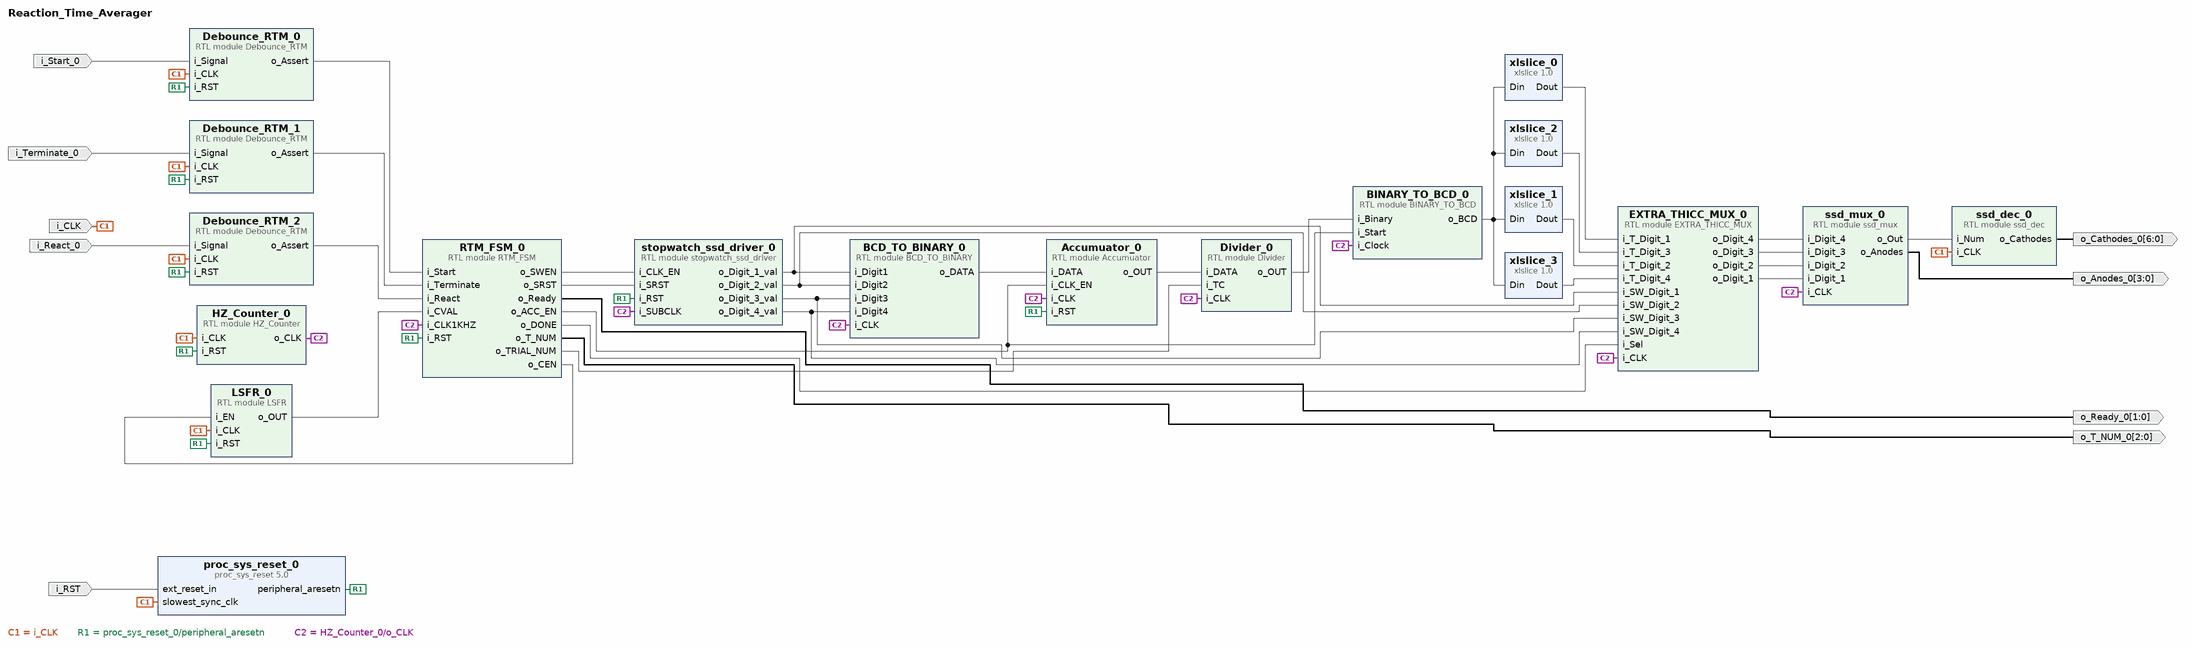
[diagram p0: block diagram of the top level]
# Vivado block design Reaction_Time_Averager, xc7z007sclg400-1, Vivado 2019.1
create_bd_design Reaction_Time_Averager

create_bd_port -dir O -from 3 -to 0 o_Anodes_0
create_bd_port -dir O -from 6 -to 0 o_Cathodes_0
create_bd_port -dir O -from 1 -to 0 o_Ready_0
create_bd_port -dir I -type clk i_CLK
create_bd_port -dir I -type rst i_RST
set_property -dict {CONFIG.POLARITY ACTIVE_LOW} [get_bd_ports i_RST]
create_bd_port -dir O -from 2 -to 0 o_T_NUM_0
create_bd_port -dir I i_Start_0
create_bd_port -dir I i_Terminate_0
create_bd_port -dir I i_React_0

create_bd_cell -type ip -vlnv xilinx.com:ip:proc_sys_reset:5.0 proc_sys_reset_0
create_bd_cell -type module -reference LSFR LSFR_0
create_bd_cell -type module -reference stopwatch_ssd_driver stopwatch_ssd_driver_0
create_bd_cell -type module -reference ssd_mux ssd_mux_0
create_bd_cell -type module -reference ssd_dec ssd_dec_0
create_bd_cell -type module -reference Accumuator Accumuator_0
create_bd_cell -type module -reference BCD_TO_BINARY BCD_TO_BINARY_0
create_bd_cell -type module -reference BINARY_TO_BCD BINARY_TO_BCD_0
create_bd_cell -type module -reference EXTRA_THICC_MUX EXTRA_THICC_MUX_0
create_bd_cell -type module -reference Divider Divider_0
create_bd_cell -type module -reference Debounce_RTM Debounce_RTM_0
create_bd_cell -type module -reference Debounce_RTM Debounce_RTM_1
create_bd_cell -type module -reference Debounce_RTM Debounce_RTM_2
create_bd_cell -type ip -vlnv xilinx.com:ip:xlslice:1.0 xlslice_0
set_property -dict {CONFIG.DIN_FROM 15 CONFIG.DIN_TO 12 CONFIG.DIN_WIDTH 16 CONFIG.DOUT_WIDTH 4} [get_bd_cells xlslice_0]
create_bd_cell -type ip -vlnv xilinx.com:ip:xlslice:1.0 xlslice_1
set_property -dict {CONFIG.DIN_FROM 11 CONFIG.DIN_TO 8 CONFIG.DIN_WIDTH 16 CONFIG.DOUT_WIDTH 4} [get_bd_cells xlslice_1]
create_bd_cell -type ip -vlnv xilinx.com:ip:xlslice:1.0 xlslice_2
set_property -dict {CONFIG.DIN_FROM 7 CONFIG.DIN_TO 4 CONFIG.DIN_WIDTH 16 CONFIG.DOUT_WIDTH 4} [get_bd_cells xlslice_2]
create_bd_cell -type ip -vlnv xilinx.com:ip:xlslice:1.0 xlslice_3
set_property -dict {CONFIG.DIN_FROM 3 CONFIG.DIN_TO 0 CONFIG.DIN_WIDTH 16 CONFIG.DOUT_WIDTH 4} [get_bd_cells xlslice_3]
create_bd_cell -type module -reference HZ_Counter HZ_Counter_0
set_property -dict {CONFIG.c_NUM 50000} [get_bd_cells HZ_Counter_0]
create_bd_cell -type module -reference RTM_FSM RTM_FSM_0

# ---- connections ----

connect_bd_net [get_bd_pins LSFR_0/o_OUT] [get_bd_pins RTM_FSM_0/i_CVAL]
connect_bd_net [get_bd_pins RTM_FSM_0/o_CEN] [get_bd_pins LSFR_0/i_EN]
connect_bd_net [get_bd_pins ssd_mux_0/o_Out] [get_bd_pins ssd_dec_0/i_Num]
connect_bd_net [get_bd_pins stopwatch_ssd_driver_0/o_Digit_1_val] [get_bd_pins BCD_TO_BINARY_0/i_Digit1] [get_bd_pins EXTRA_THICC_MUX_0/i_SW_Digit_1]
connect_bd_net [get_bd_pins stopwatch_ssd_driver_0/o_Digit_2_val] [get_bd_pins BCD_TO_BINARY_0/i_Digit2] [get_bd_pins EXTRA_THICC_MUX_0/i_SW_Digit_2]
connect_bd_net [get_bd_pins stopwatch_ssd_driver_0/o_Digit_3_val] [get_bd_pins BCD_TO_BINARY_0/i_Digit3] [get_bd_pins EXTRA_THICC_MUX_0/i_SW_Digit_3]
connect_bd_net [get_bd_pins stopwatch_ssd_driver_0/o_Digit_4_val] [get_bd_pins BCD_TO_BINARY_0/i_Digit4] [get_bd_pins EXTRA_THICC_MUX_0/i_SW_Digit_4]
connect_bd_net [get_bd_pins ssd_mux_0/o_Anodes] [get_bd_ports o_Anodes_0]
connect_bd_net [get_bd_pins ssd_dec_0/o_Cathodes] [get_bd_ports o_Cathodes_0]
connect_bd_net [get_bd_pins RTM_FSM_0/o_Ready] [get_bd_ports o_Ready_0]
connect_bd_net [get_bd_ports i_CLK] \
  [get_bd_pins proc_sys_reset_0/slowest_sync_clk] [get_bd_pins LSFR_0/i_CLK] [get_bd_pins ssd_dec_0/i_CLK] \
  [get_bd_pins Debounce_RTM_0/i_CLK] [get_bd_pins Debounce_RTM_1/i_CLK] [get_bd_pins Debounce_RTM_2/i_CLK] \
  [get_bd_pins HZ_Counter_0/i_CLK]
connect_bd_net [get_bd_pins proc_sys_reset_0/peripheral_aresetn] \
  [get_bd_pins LSFR_0/i_RST] [get_bd_pins stopwatch_ssd_driver_0/i_RST] [get_bd_pins Accumuator_0/i_RST] \
  [get_bd_pins Debounce_RTM_0/i_RST] [get_bd_pins Debounce_RTM_1/i_RST] [get_bd_pins Debounce_RTM_2/i_RST] \
  [get_bd_pins HZ_Counter_0/i_RST] [get_bd_pins RTM_FSM_0/i_RST]
connect_bd_net [get_bd_ports i_RST] [get_bd_pins proc_sys_reset_0/ext_reset_in]
connect_bd_net [get_bd_pins RTM_FSM_0/o_SWEN] [get_bd_pins stopwatch_ssd_driver_0/i_CLK_EN]
connect_bd_net -net HZ_Counter_0_o_Out [get_bd_pins HZ_Counter_0/o_CLK] \
  [get_bd_pins stopwatch_ssd_driver_0/i_SUBCLK] [get_bd_pins ssd_mux_0/i_CLK] [get_bd_pins Accumuator_0/i_CLK] \
  [get_bd_pins BCD_TO_BINARY_0/i_CLK] [get_bd_pins BINARY_TO_BCD_0/i_Clock] [get_bd_pins EXTRA_THICC_MUX_0/i_CLK] \
  [get_bd_pins Divider_0/i_CLK] [get_bd_pins RTM_FSM_0/i_CLK1KHZ]
connect_bd_net [get_bd_pins BCD_TO_BINARY_0/o_DATA] [get_bd_pins Accumuator_0/i_DATA]
connect_bd_net -net BINARY_TO_BCD_0_o_Digit1 [get_bd_pins xlslice_0/Dout] [get_bd_pins EXTRA_THICC_MUX_0/i_T_Digit_1]
connect_bd_net -net BINARY_TO_BCD_0_o_Digit2 [get_bd_pins xlslice_1/Dout] [get_bd_pins EXTRA_THICC_MUX_0/i_T_Digit_2]
connect_bd_net -net BINARY_TO_BCD_0_o_Digit3 [get_bd_pins xlslice_2/Dout] [get_bd_pins EXTRA_THICC_MUX_0/i_T_Digit_3]
connect_bd_net -net BINARY_TO_BCD_0_o_Digit4 [get_bd_pins xlslice_3/Dout] [get_bd_pins EXTRA_THICC_MUX_0/i_T_Digit_4]
connect_bd_net [get_bd_pins EXTRA_THICC_MUX_0/o_Digit_4] [get_bd_pins ssd_mux_0/i_Digit_4]
connect_bd_net [get_bd_pins EXTRA_THICC_MUX_0/o_Digit_3] [get_bd_pins ssd_mux_0/i_Digit_3]
connect_bd_net [get_bd_pins EXTRA_THICC_MUX_0/o_Digit_2] [get_bd_pins ssd_mux_0/i_Digit_2]
connect_bd_net [get_bd_pins EXTRA_THICC_MUX_0/o_Digit_1] [get_bd_pins ssd_mux_0/i_Digit_1]
connect_bd_net [get_bd_pins RTM_FSM_0/o_ACC_EN] [get_bd_pins Accumuator_0/i_CLK_EN] [get_bd_pins BINARY_TO_BCD_0/i_Start]
connect_bd_net [get_bd_pins RTM_FSM_0/o_DONE] [get_bd_pins EXTRA_THICC_MUX_0/i_Sel]
connect_bd_net [get_bd_pins RTM_FSM_0/o_T_NUM] [get_bd_ports o_T_NUM_0]
connect_bd_net [get_bd_pins BINARY_TO_BCD_0/o_BCD] \
  [get_bd_pins xlslice_0/Din] [get_bd_pins xlslice_1/Din] [get_bd_pins xlslice_2/Din] [get_bd_pins xlslice_3/Din]
connect_bd_net [get_bd_pins RTM_FSM_0/o_SRST] [get_bd_pins stopwatch_ssd_driver_0/i_SRST]
connect_bd_net [get_bd_pins Accumuator_0/o_OUT] [get_bd_pins Divider_0/i_DATA]
connect_bd_net [get_bd_pins Divider_0/o_OUT] [get_bd_pins BINARY_TO_BCD_0/i_Binary]
connect_bd_net [get_bd_pins RTM_FSM_0/o_TRIAL_NUM] [get_bd_pins Divider_0/i_TC]
connect_bd_net -net i_Start_0_1 [get_bd_ports i_Start_0] [get_bd_pins Debounce_RTM_0/i_Signal]
connect_bd_net -net i_Terminate_0_1 [get_bd_ports i_Terminate_0] [get_bd_pins Debounce_RTM_1/i_Signal]
connect_bd_net -net i_React_0_1 [get_bd_ports i_React_0] [get_bd_pins Debounce_RTM_2/i_Signal]
connect_bd_net [get_bd_pins Debounce_RTM_0/o_Assert] [get_bd_pins RTM_FSM_0/i_Start]
connect_bd_net [get_bd_pins Debounce_RTM_1/o_Assert] [get_bd_pins RTM_FSM_0/i_Terminate]
connect_bd_net [get_bd_pins Debounce_RTM_2/o_Assert] [get_bd_pins RTM_FSM_0/i_React]

validate_bd_design
save_bd_design
